# EAGLE design mcp23017-board (EAGLE 6.3)
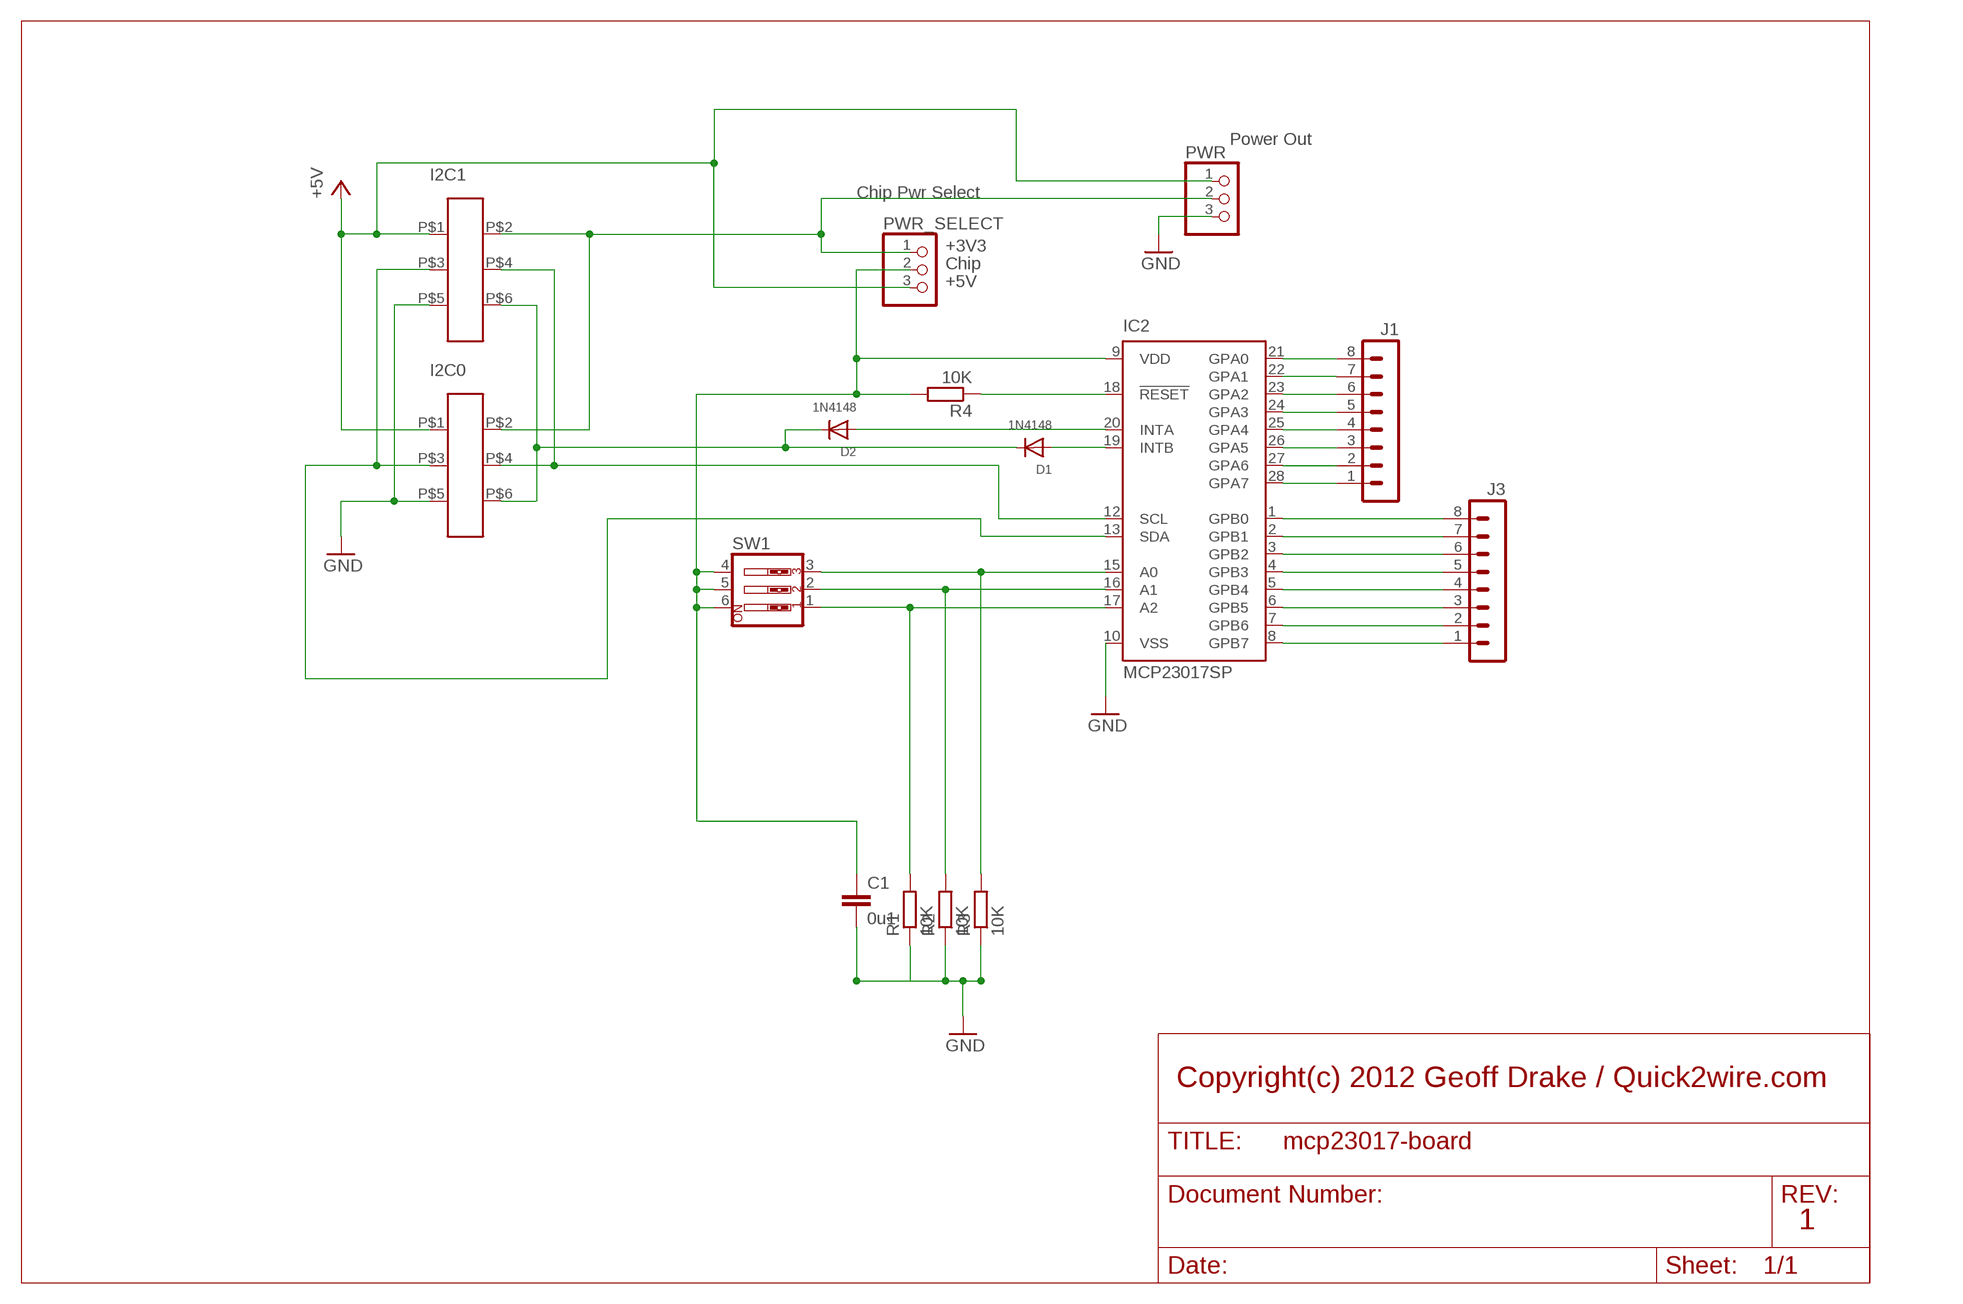
[diagram p0: schematic, sheet 1]

## Parts
C1  0u1  C-EU025-030X050  [C025-030X050]
D1  1N4148  DIODEDO-1N4148  [DO-1N4148]
D2  1N4148  DIODEDO-1N4148  [DO-1N4148]
I2C0  IDC-6W  [IDC-6W]
I2C1  IDC-6W  [IDC-6W]
IC2  MCP23017SP  [DIL28-3]
J1  MA08-1  [MA08-1]
J3  MA08-1  [MA08-1]
PWR  PINHD-1X3  [1X03]
PWR_SELECT  PINHD-1X3  [1X03]
R1  10K  R-EU_0207/10  [0207/10]
R2  10K  R-EU_0207/10  [0207/10]
R3  10K  R-EU_0207/10  [0207/10]
R4  10K  R-EU_0207/10  [0207/10]
SW1  SW_DIP-3  [EDG-03]

## Nets
+3V3 [pwr]: I2C0.P$2 I2C1.P$2 PWR.2 PWR_SELECT.1
+5V [pwr]: I2C0.P$1 I2C1.P$1 PWR.1 PWR_SELECT.3
A0: IC2.17(A2) R1.2 SW1.1
A1: IC2.16(A1) R2.2 SW1.2
A2: IC2.15(A0) R3.2 SW1.3
GND [pwr]: C1.2 I2C0.P$5 I2C1.P$5 IC2.10(VSS) PWR.3 R1.1 R2.1 R3.1
N$1: I2C0.P$3 I2C1.P$3 IC2.13(SDA)
N$2: I2C0.P$4 I2C1.P$4 IC2.12(SCL)
N$3: D1.A IC2.19(INTB)
N$5: D2.A IC2.20(INTA)
N$6: IC2.18(!RESET) R4.1
N$23 [pwr]: C1.1 IC2.9(VDD) PWR_SELECT.2 R4.2 SW1.4 SW1.5 SW1.6
N$25: D1.C D2.C I2C0.P$6 I2C1.P$6
PA0: IC2.21(GPA0) J1.8
PA1: IC2.22(GPA1) J1.7
PA2: IC2.23(GPA2) J1.6
PA3: IC2.24(GPA3) J1.5
PA4: IC2.25(GPA4) J1.4
PA5: IC2.26(GPA5) J1.3
PA6: IC2.27(GPA6) J1.2
PA7: IC2.28(GPA7) J1.1
PB0: IC2.1(GPB0) J3.8
PB1: IC2.2(GPB1) J3.7
PB2: IC2.3(GPB2) J3.6
PB3: IC2.4(GPB3) J3.5
PB4: IC2.5(GPB4) J3.4
PB5: IC2.6(GPB5) J3.3
PB6: IC2.7(GPB6) J3.2
PB7: IC2.8(GPB7) J3.1

## Notes on the sheet
- Power Out
- Chip Pwr Select
- +3V3
- Chip
- +5V
- Copyright(c) 2012 Geoff Drake / Quick2wire.com
- 1

## Library data of the parts
C1 = rcl:C-EU: CAPACITOR, European symbol
D1 D2 = adafruit:DIODE: Diode SMADIODE - SMA Surface Mount Package 20V 1A Schottky Diode Digikey: 641-1014-6-ND DO-1N4148 - Through Hole Small Current Diode SOD-123 20V 1 A (.5mV Vf) Schottky Diode - Digikey: MBRX120TPMSCT-ND SOD-323 10V 570mA (.38mV Vf, 3ns) Schottky Diode - Digikey: ZLLS410CT-ND SOD-523 30V 30mA Schottky Diode (RB751S-40TE61) - Digikey: RB751S-40TE61CT-ND SOT23-R/W - SOT23 Package (R = Solder Paste/Reflow Ovens, W = Hand-Soldering) BAT54Film 40V 300mA - Digikey: 497-7162-1-ND
I2C0 I2C1 = quick2wire:IDC-6W: 6 Way IDC Connector
IC2 = adafruit:MCP23017: http://ww1.microchip.com/downloads/en/DeviceDoc/21952a.pdf Source: http://ww1.microchip.com/downloads/en/DeviceDoc/21952a.pdf
J1 J3 = con-lstb:MA08-1: PIN HEADER; OC_FARNELL: unknown; OC_NEWARK: unknown
PWR PWR_SELECT = adafruit:PINHD-1X3: PIN HEADER
R1-R4 = rcl:R-EU_: RESISTOR, European symbol
SW1 = special:SW_DIP-3: DIP SWITCH

## Net classes
0 default: width 0.254 mm, clearance 0.254 mm
1 pwr: width 0.254 mm, clearance 0.356 mm

## Board
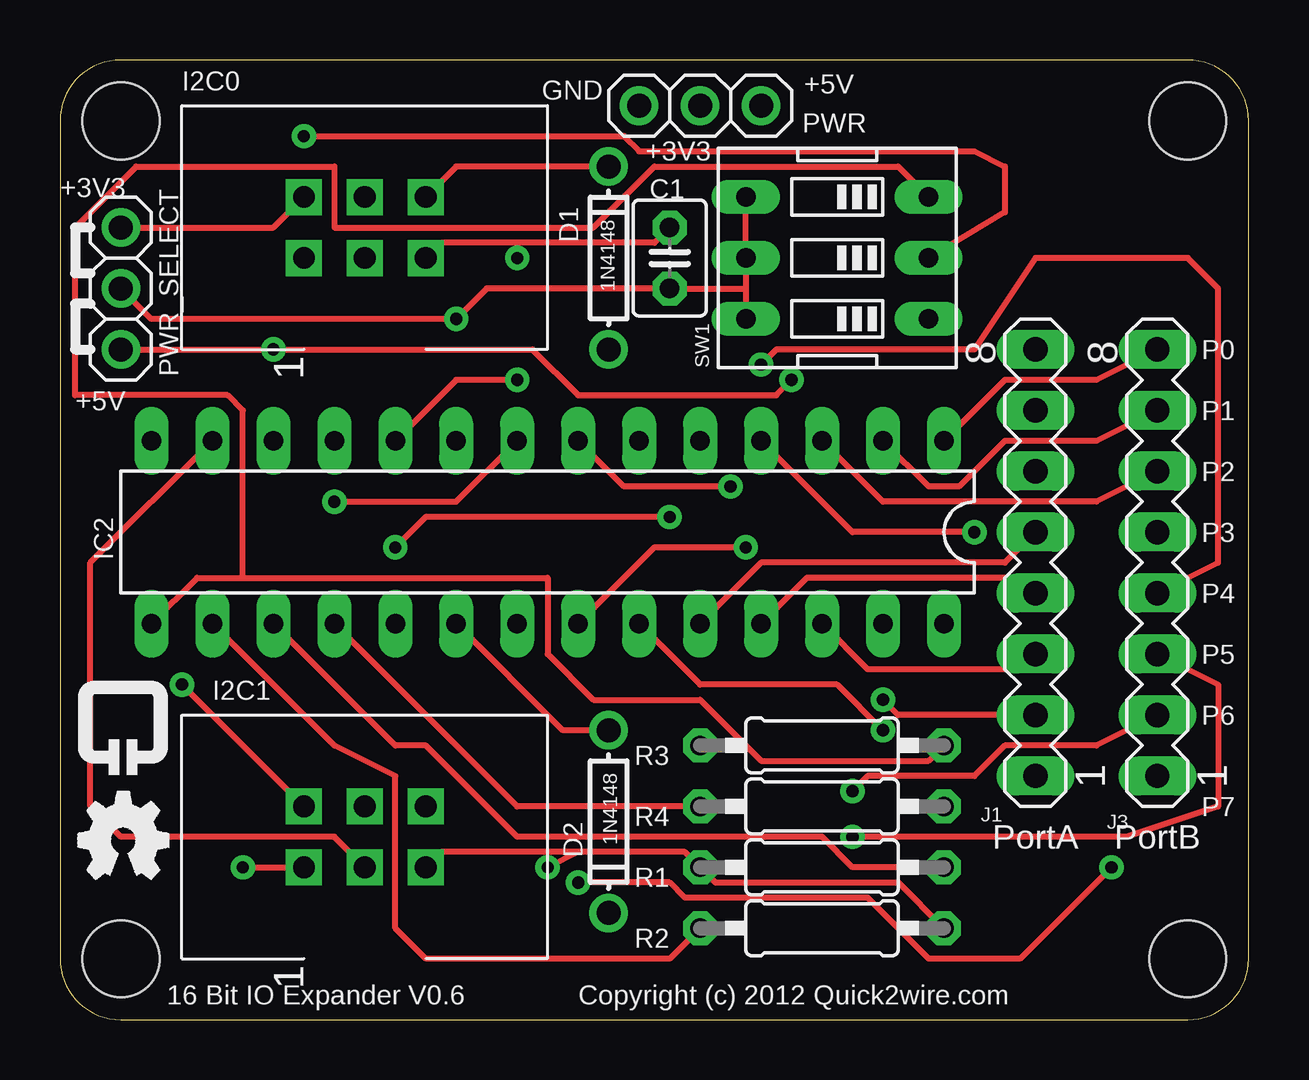
[diagram p1: board, top side]
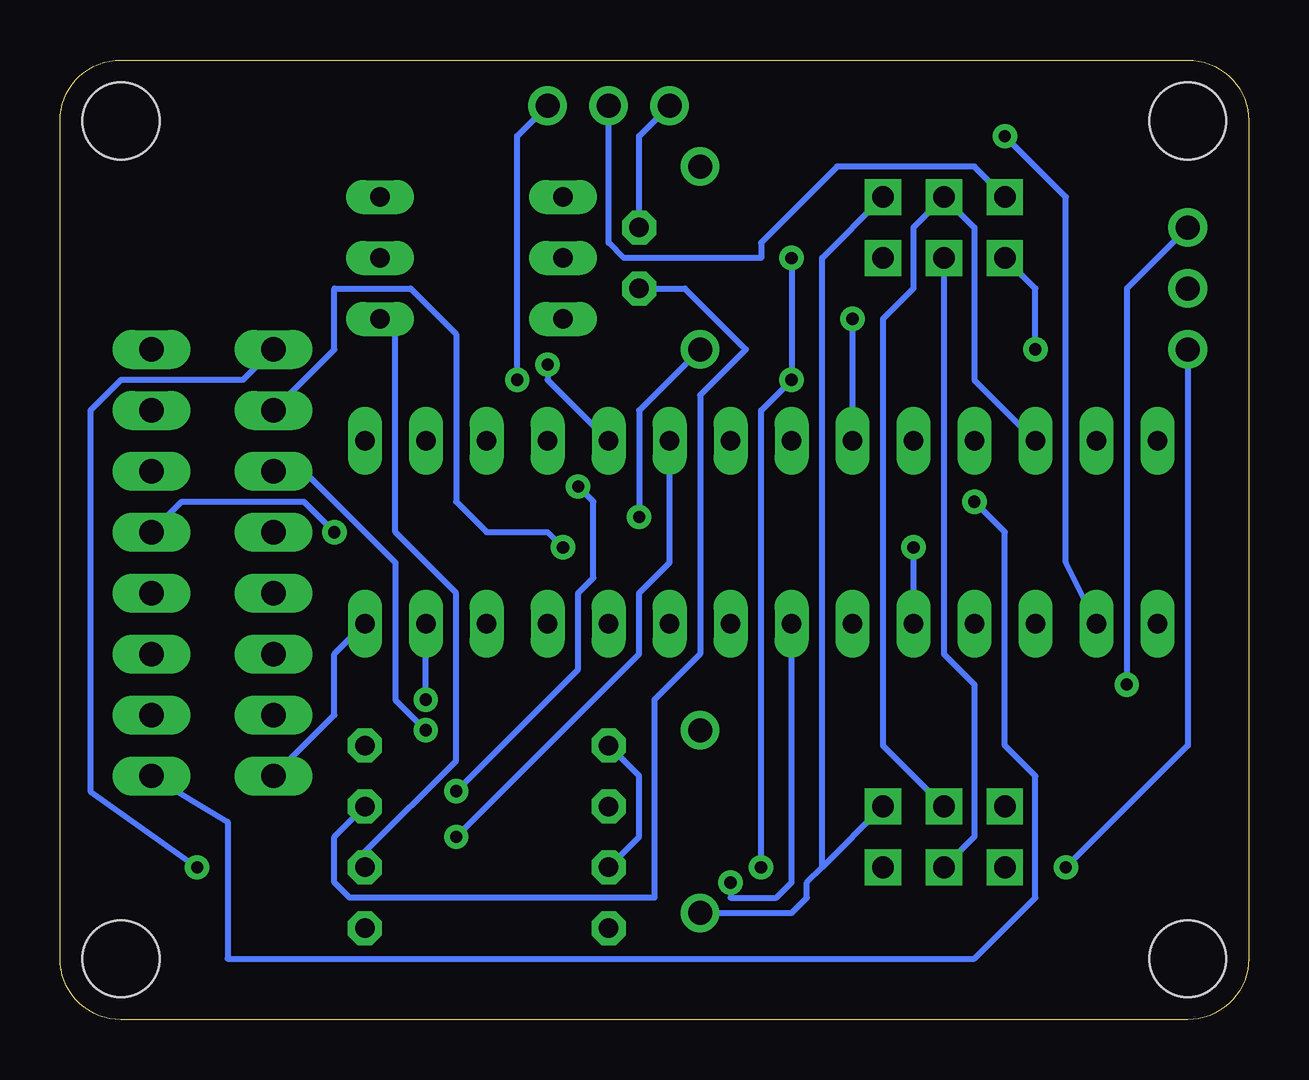
[diagram p2: board, bottom side, seen from below]

Size 49.53 x 40.01 mm. Coordinates in mm from the lower left corner, seen from the top.
Outline: 2.54,0 46.99,0 arc90 49.53,2.54 49.53,37.47 arc90 46.99,40.01 2.54,40.01 arc90 0,37.47 0,2.54 arc90 2.54,0
Copper layers (1*16): Top 0.035mm / dielectric 1.5mm / Bottom 0.035mm
Design rules "default": minimum track width 8mil, minimum drill 20mil, track to track 8mil, track to pad 8mil, pad to pad 8mil, via to via 8mil, smd to smd 8mil, copper to edge 10mil, drill to drill 8mil, minimum pad ring 12mil, minimum via ring 10mil, stop-mask expansion 4mil, vias tented up to drill 25mil, thermal gap 10mil
Holes 3.2 mm at 46.99,37.47 46.99,2.54 2.54,2.54 2.54,37.47

### Footprints (pad centres in the part's own frame; a part is rotated, then mirrored left to right if it is on the bottom)
C025-030X050 = drill 0.813 octagon: 1 -1.27,0; 2 1.27,0
DO-1N4148 = drill 1: A -3.81,0; C 3.81,0
IDC-6W = drill 0.9 square: P$1 -1.27,2.54; P$2 1.27,2.54; P$3 -1.27,0; P$4 1.27,0; P$5 -1.27,-2.54; P$6 1.27,-2.54
DIL28-3 = drill 0.813 long: 1 -16.51,-3.81; 2 -13.97,-3.81; 3 -11.43,-3.81; 4 -8.89,-3.81; 5 -6.35,-3.81; 6 -3.81,-3.81; 7 -1.27,-3.81; 8 1.27,-3.81; 9 3.81,-3.81; 10 6.35,-3.81; 11 8.89,-3.81; 12 11.43,-3.81; 13 13.97,-3.81; 14 16.51,-3.81; 15 16.51,3.81; 16 13.97,3.81; 17 11.43,3.81; 18 8.89,3.81; 19 6.35,3.81; 20 3.81,3.81; 21 1.27,3.81; 22 -1.27,3.81; 23 -3.81,3.81; 24 -6.35,3.81; 25 -8.89,3.81; 26 -11.43,3.81; 27 -13.97,3.81; 28 -16.51,3.81
MA08-1 = drill 1.016 long: 1 -8.89,0; 2 -6.35,0; 3 -3.81,0; 4 -1.27,0; 5 1.27,0; 6 3.81,0; 7 6.35,0; 8 8.89,0
1X03 = drill 1: 1 -2.54,0; 2 0,0; 3 2.54,0
0207/10 = drill 0.813 octagon: 1 -5.08,0; 2 5.08,0
EDG-03 = drill 0.813 long: 1 -2.54,-3.81; 2 0,-3.81; 3 2.54,-3.81; 4 2.54,3.81; 5 0,3.81; 6 -2.54,3.81

### Placement (x,y rotation side)
C1  25.4,31.75 90 top
D1  22.86,31.75 90 top
D2  22.86,8.26 270 top
I2C0  12.7,33.02 90 top
I2C1  12.7,7.62 90 top
IC2  20.32,20.32 180 top
J1  40.64,19.05 90 top
J3  45.72,19.05 90 top
PWR  26.67,38.1 180 top
PWR_SELECT  2.54,30.48 270 top
R1  31.75,6.35 0 top
R2  31.75,3.81 180 top
R3  31.75,11.43 0 top
R4  31.75,8.89 0 top
SW1  32.38,31.75 90 top
U$1  [QUICK2WIRE-LOGO]  0.64,10.16 0 top
U$2  [OSHW-LOGO]  0.64,5.71 0 top

### Tracks (layer width: path | path; a pad name or v marks a point on that pad's centre or on a via)
+3V3  (via drill 0.51)
  Top 0.254: v5.08,13.97 I2C1.P$2 | I2C0.P$2 8.89,33.02 PWR_SELECT.1
  Bottom 0.254: v5.08,13.97 5.08,30.48 PWR_SELECT.1 | PWR.2 26.67,32.38 26.04,31.75 20.32,31.75 20.32,32.38 17.14,35.56 11.43,35.56 I2C0.P$2
+5V  (via drill 0.51)
  Top 0.254: v7.62,6.35 I2C1.P$1 | PWR_SELECT.3 v8.89,27.94 19.68,27.94 21.59,26.04 29.84,26.04 v30.48,26.67
  Bottom 0.254: v7.62,6.35 2.54,11.43 PWR_SELECT.3 | I2C0.P$1 8.89,30.48 v8.89,27.94 | PWR.1 30.48,36.83 v30.48,26.67
A0
  Top 0.254: IC2.17 13.97,11.43 15.24,11.43 19.05,7.62 31.75,7.62 33.02,6.35 R1.2
  Bottom 0.254: SW1.1 35.56,28.57 35.56,20.32 33.02,17.78 33.02,10.79 36.83,6.99 R1.2
A1  (via drill 0.51)
  Top 0.254: IC2.16 11.43,11.43 13.97,10.16 13.97,3.81 15.24,2.54 25.4,2.54 R2.2 | SW1.2 39.37,33.66 39.37,35.56 38.1,36.2 24.13,36.2 23.5,36.83 v10.16,36.83
  Bottom 0.254: v10.16,36.83 7.62,34.29 7.62,19.05 IC2.16
A2
  Top 0.254: R3.2 36.2,10.79 29.21,10.79 26.67,13.34 22.23,13.34 20.32,15.24 20.32,18.41 7.62,18.41 | 7.62,18.41 5.71,18.41 IC2.15 | SW1.3 34.92,35.56 24.77,35.56 22.23,33.02 11.43,33.02 11.43,35.56 3.17,35.56 0.64,33.02 0.64,26.04 6.99,26.04 7.62,25.4 7.62,18.41
GND  (via drill 0.51)
  Top 0.254: I2C0.P$5 15.88,32.38 19.05,32.38 | 19.05,32.38 24.77,32.38 C1.2 | IC2.10 16.51,26.67 v19.05,26.67 | 19.05,32.38 v19.05,31.75 | I2C1.P$5 15.88,6.99 21.59,6.99 | 21.59,6.99 26.04,6.99 R1.1 27.3,5.71 34.92,5.71 R2.1 | 21.59,6.99 v20.32,6.35
  Bottom 0.254: v19.05,31.75 v19.05,26.67 20.32,25.4 v20.32,6.35 | PWR.3 25.4,36.83 C1.2 | R3.1 25.4,10.16 25.4,7.62 R1.1
N$1
  Top 0.254: IC2.13 1.27,19.05 1.27,8.89 2.54,7.62 11.43,7.62 I2C1.P$3
  Bottom 0.254: I2C1.P$3 11.43,7.62 11.43,13.97 12.7,15.24 I2C0.P$3
N$2
  Bottom 0.254: I2C1.P$4 15.24,11.43 15.24,29.21 13.97,30.48 13.97,33.02 I2C0.P$4 11.43,33.02 11.43,26.67 IC2.12
N$3  (via drill 0.51)
  Top 0.254: v13.97,19.68 15.24,20.95 v25.4,20.95
  Bottom 0.254: v13.97,19.68 IC2.19 | v25.4,20.95 25.4,25.4 D1.A
N$5
  Top 0.254: IC2.20 20.95,12.06 D2.A
N$6
  Top 0.254: IC2.18 19.05,8.89 R4.1
N$23  (via drill 0.51)
  Top 0.254: 28.57,30.48 SW1.5 SW1.4 | 28.57,30.48 SW1.6 | PWR_SELECT.2 3.81,29.21 v16.51,29.21 17.78,30.48 C1.1 28.57,30.48
  Bottom 0.254: v16.51,29.21 IC2.9 | R4.2 38.1,7.62 38.1,5.71 37.47,5.08 24.77,5.08 24.77,13.34 22.86,15.24 22.86,26.04 20.95,27.94 23.5,30.48 C1.1
N$25
  Top 0.254: I2C0.P$6 16.51,35.56 D1.C
  Bottom 0.254: 17.78,6.35 18.41,5.71 18.41,5.08 19.05,4.45 D2.C | 17.78,6.35 I2C1.P$6 | I2C0.P$6 17.78,31.75 17.78,6.35
PA0  (via drill 0.51)
  Top 0.254: v21.59,5.71 25.4,5.71 26.04,5.08 33.66,5.08 36.2,2.54 40.01,2.54 v43.81,6.35
  Bottom 0.254: IC2.21 19.05,5.71 19.68,5.08 21.59,5.08 v21.59,5.71 | v43.81,6.35 48.26,9.53 48.26,25.4 46.99,26.67 41.91,26.67 J1.8
PA1  (via drill 0.51)
  Top 0.254: IC2.22 24.77,19.68 v28.57,19.68
  Bottom 0.254: v28.57,19.68 29.21,20.32 31.75,20.32 33.02,21.59 33.02,28.57 34.92,30.48 38.1,30.48 38.1,27.94 J1.7
PA2  (via drill 0.51)
  Top 0.254: IC2.23 26.67,13.97 32.38,13.97 v34.29,12.06
  Bottom 0.254: v34.29,12.06 35.56,13.34 35.56,19.05 39.37,22.86 J1.6
PA3
  Top 0.254: IC2.24 29.21,19.05 39.37,19.05 J1.5
PA4
  Top 0.254: IC2.25 31.11,18.41 40.01,18.41 J1.4
PA5
  Top 0.254: IC2.26 33.66,14.61 40.01,14.61 J1.3
PA6  (via drill 0.51)
  Top 0.254: v34.29,13.34 34.92,12.7 J1.2
  Bottom 0.254: v34.29,13.34 IC2.27
PA7
  Bottom 0.254: IC2.28 38.1,15.24 38.1,12.7 J1.1
PB0
  Top 0.254: IC2.1 39.37,26.67 43.18,26.67 J3.8
PB1
  Top 0.254: IC2.2 36.2,22.23 37.47,22.23 39.37,24.13 43.18,24.13 J3.7
PB2
  Top 0.254: IC2.3 34.29,21.59 43.18,21.59 J3.6
PB3  (via drill 0.51)
  Top 0.254: IC2.4 33.02,20.32 v38.1,20.32
  Bottom 0.254: v38.1,20.32 39.37,21.59 44.45,21.59 J3.5
PB4  (via drill 0.51)
  Top 0.254: v29.21,27.3 29.84,27.94 38.1,27.94 40.64,31.75 46.99,31.75 48.26,30.48 48.26,19.05 J3.4
  Bottom 0.254: IC2.5 29.21,26.67 v29.21,27.3
PB5  (via drill 0.51)
  Top 0.254: v33.02,7.62 44.45,7.62 48.26,8.89 48.26,13.97 J3.3
  Bottom 0.254: IC2.6 24.13,19.05 25.4,17.78 25.4,15.24 v33.02,7.62
PB6  (via drill 0.51)
  Top 0.254: IC2.7 23.5,22.23 v27.94,22.23 | v33.02,9.53 33.66,10.16 38.1,10.16 39.37,11.43 43.18,11.43 J3.2
  Bottom 0.254: v27.94,22.23 27.3,21.59 27.3,18.41 27.94,17.78 27.94,14.61 v33.02,9.53
PB7  (via drill 0.51)
  Top 0.254: IC2.8 16.51,21.59 v11.43,21.59
  Bottom 0.254: v11.43,21.59 10.16,20.32 10.16,11.43 8.89,10.16 8.89,5.08 11.43,2.54 42.55,2.54 42.55,8.26 J3.1

### Text on the board
tPlace: PortA | PortB | 16 Bit IO Expander V0.6 | Copyright (c) 2012 Quick2wire.com
tNames: +5V | GND | +3V3 | +3V3 | P0 | +5V | P1 | P2 | P3 | P4 | P5 | P6 | P7